# Altium schematic sheet analog.SchDoc: SCOPE-F07x: analog
size A4; Organization: Draw By: OldGerman; Address2: https://github.com; Address3: /oldgerman/SCOPE-F07x; Revision: v1.1; SheetNumber: 2; SheetTotal: 5
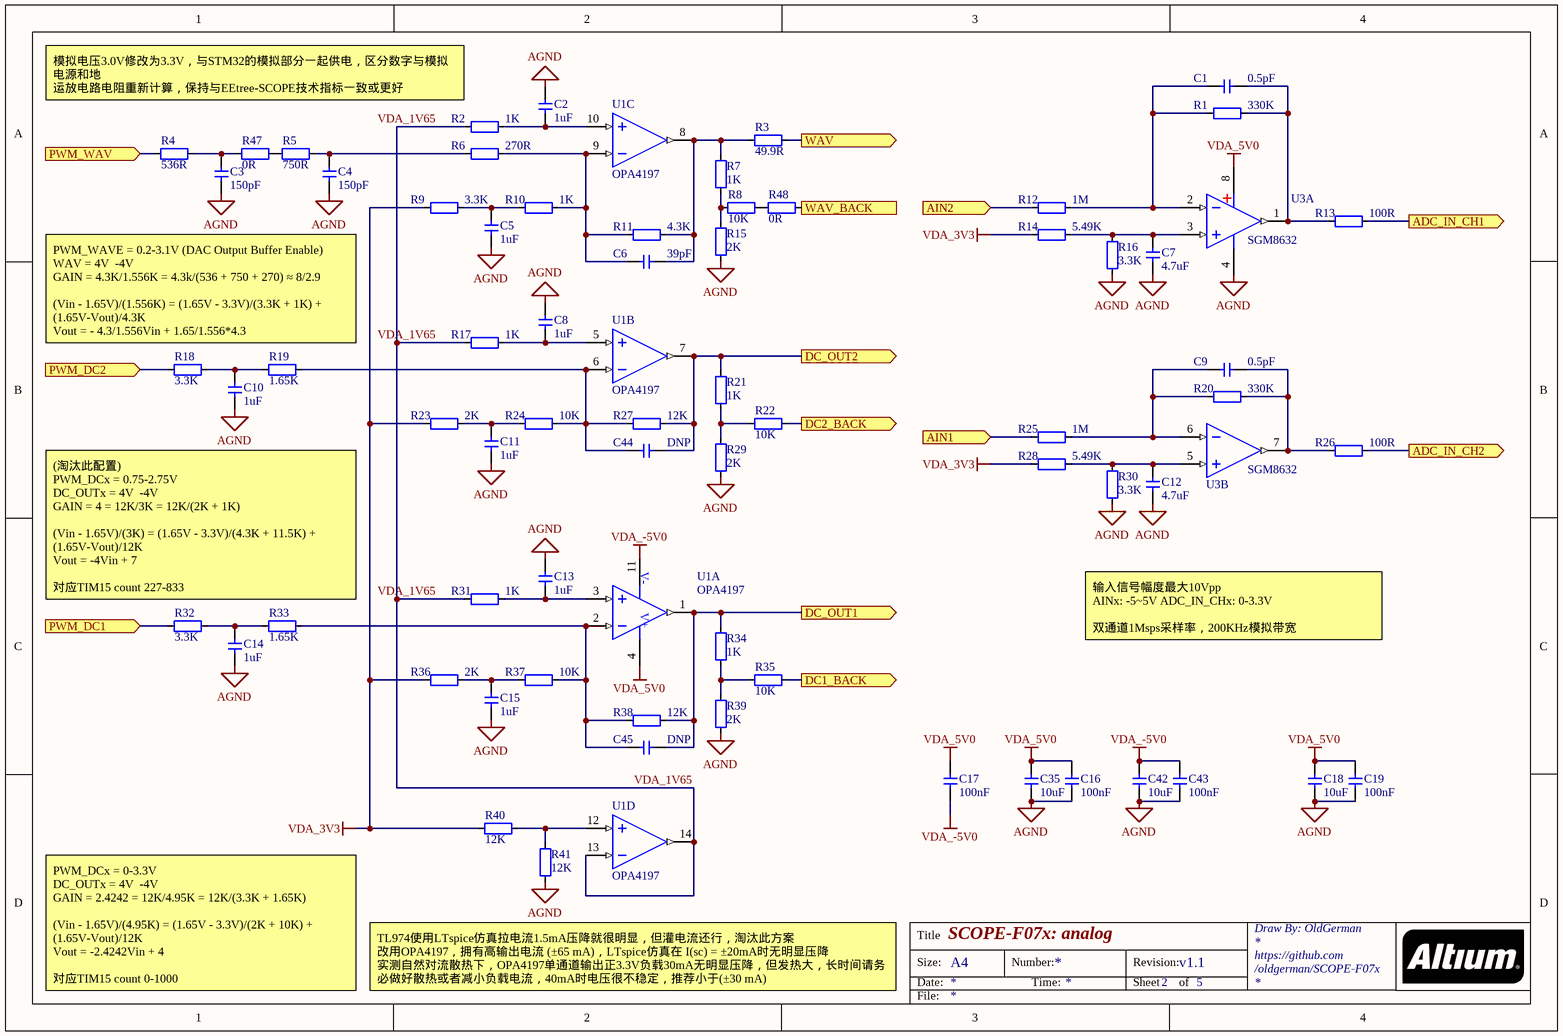
[diagram p0: analog.SchDoc]

## Parts
C1  0.5pF  [C0402]
C2  1uF  [C0402]
C3  150pF  [C0402]
C4  150pF  [C0402]
C5  1uF  [C0402]
C6  39pF  [C0402]
C7  4.7uF  [C0402]
C8  1uF  [C0402]
C9  0.5pF  [C0402]
C10  1uF  [C0402]
C11  1uF  [C0402]
C12  4.7uF  [C0402]
C13  1uF  [C0402]
C14  1uF  [C0402]
C15  1uF  [C0402]
C16  100nF  [C0402]
C17  100nF  [C0402]
C18  10uF  [C0402]
C19  100nF  [C0402]
C35  10uF  [C0402]
C42  10uF  [C0402]
C43  100nF  [C0402]
C44  DNP  [C0402]
C45  DNP  [C0402]
R1  330K  [R0402]
R2  1K  [R0402]
R3  49.9R  [R0402]
R4  536R  [R0402]
R5  750R  [R0402]
R6  270R  [R0402]
R7  1K  [R0402]
R8  10K  [R0402]
R9  3.3K  [R0402]
R10  1K  [R0402]
R11  4.3K  [R0402]
R12  1M  [R0402]
R13  100R  [R0402]
R14  5.49K  [R0402]
R15  2K  [R0402]
R16  3.3K  [R0402]
R17  1K  [R0402]
R18  3.3K  [R0402]
R19  1.65K  [R0402]
R20  330K  [R0402]
R21  1K  [R0402]
R22  10K  [R0402]
R23  2K  [R0402]
R24  10K  [R0402]
R25  1M  [R0402]
R26  100R  [R0402]
R27  12K  [R0402]
R28  5.49K  [R0402]
R29  2K  [R0402]
R30  3.3K  [R0402]
R31  1K  [R0402]
R32  3.3K  [R0402]
R33  1.65K  [R0402]
R34  1K  [R0402]
R35  10K  [R0402]
R36  2K  [R0402]
R37  10K  [R0402]
R38  12K  [R0402]
R39  2K  [R0402]
R40  12K  [R0402]
R41  12K  [R0402]
R47  0R  [R0805]
R48  0R  [R0805]
U1  OPA4197  [ON SEMI TSSOP-14 948G]  (parts A,B,C,D of 4)
U3  SGM8632  [ANALOG DEV SOIC-8 R8]  (parts A,B of 2)

## Ports
ADC_IN_CH1 (out), ADC_IN_CH2 (out), AIN1 (in), AIN2 (in), DC1_BACK (out), DC2_BACK (out), DC_OUT1 (out), DC_OUT2 (out), PWM_DC1 (in), PWM_DC2 (in), PWM_WAV (in), WAV (out), WAV_BACK (out)

## Nets
AGND: C2.2 C3.1 C4.1 C5.1 C7.1 C8.2 C10.1 C11.1 C12.1 C13.2 C14.1 C15.1 C16.1 C18.1 C19.1 C35.1 C42.1 C43.1 R15.1 R16.1 R29.1 R30.1 R39.1 R41.1 U3.4(V-)
VDA_3V3: R9.1 R14.1 R23.1 R28.1 R36.1 R40.1
VDA_5V0: C16.2 C17.2 C18.2 C19.2 C35.2 U1.4(VDD) U3.8(V+)
VDA_-5V0: C17.1 C42.2 C43.2 U1.11(VSS)
ADC_IN_CH1: R13.2 ; port ADC_IN_CH1
ADC_IN_CH2: R26.2 ; port ADC_IN_CH2
AIN1: R25.1 ; port AIN1
AIN2: R12.1 ; port AIN2
DC1_BACK: R35.1 ; port DC1_BACK
DC2_BACK: R22.1 ; port DC2_BACK
DC_OUT1: C45.1 R34.2 R38.2 U1.1(OUTA) ; port DC_OUT1
DC_OUT2: C44.1 R21.2 R27.2 U1.7(OUTB) ; port DC_OUT2
PWM_DC1: R32.1 ; port PWM_DC1
PWM_DC2: R18.1 ; port PWM_DC2
PWM_WAV: R4.1 ; port PWM_WAV
VDA_1V65: R2.1 R17.1 R31.1 U1.13(IN_D-) U1.14(OUTD)
WAV: R3.2 ; port WAV
WAV_BACK: R48.2 ; port WAV_BACK
NetC1_1: C1.1 R1.2 R13.1 U3.1(OUT1)
NetC1_2: C1.2 R1.1 R12.2 U3.2(-)
NetC2_1: C2.1 R2.2 U1.10(IN_C+)
NetC3_2: C3.2 R4.2 R47.1
NetC4_2: C4.2 R5.2 R6.1
NetC5_2: C5.2 R9.2 R10.1
NetC6_1: C6.1 R3.1 R7.2 R11.2 U1.8(OUTC)
NetC6_2: C6.2 R6.2 R10.2 R11.1 U1.9(IN_C-)
NetC7_2: C7.2 R14.2 R16.2 U3.3(+)
NetC8_1: C8.1 R17.2 U1.5(IN_B+)
NetC9_1: C9.1 R20.2 R26.1 U3.7(OUT2)
NetC9_2: C9.2 R20.1 R25.2 U3.6(-)
NetC10_2: C10.2 R18.2 R19.1
NetC11_2: C11.2 R23.2 R24.1
NetC12_2: C12.2 R28.2 R30.2 U3.5(+)
NetC13_1: C13.1 R31.2 U1.3(IN_A+)
NetC14_2: C14.2 R32.2 R33.1
NetC15_2: C15.2 R36.2 R37.1
NetC44_2: C44.2 R19.2 R24.2 R27.1 U1.6(IN_B-)
NetC45_2: C45.2 R33.2 R37.2 R38.1 U1.2(IN_A-)
NetR5_1: R5.1 R47.2
NetR7_1: R7.1 R8.2 R15.2
NetR8_1: R8.1 R48.1
NetR21_1: R21.1 R22.2 R29.2
NetR34_1: R34.1 R35.2 R39.2
NetR40_2: R40.2 R41.2 U1.12(IN_D+)

## Notes on the sheet
- (near R2) 模拟电压3.0V修改为3.3V，与STM32的模拟部分一起供电，区分数字与模拟电源和地
  运放电路电阻重新计算，保持与EEtree-SCOPE技术指标一致或更好
- PWM_WAVE = 0.2-3.1V (DAC Output Buffer Enable)
  WAV = 4V  -4V
  GAIN = 4.3K/1.556K = 4.3k/(536 + 750 + 270) ≈ 8/2.9
  (Vin - 1.65V)/(1.556K) = (1.65V - 3.3V)/(3.3K + 1K) + (1.65V-Vout)/4.3K
  Vout = - 4.3/1.556Vin + 1.65/1.556*4.3
- (淘汰此配置)
  PWM_DCx = 0.75-2.75V
  DC_OUTx = 4V  -4V
  GAIN = 4 = 12K/3K = 12K/(2K + 1K)
  (Vin - 1.65V)/(3K) = (1.65V - 3.3V)/(4.3K + 11.5K) + (1.65V-Vout)/12K
  Vout = -4Vin + 7
  对应TIM15 count 227-833
- 输入信号幅度最大10Vpp
  AINx: -5~5V ADC_IN_CHx: 0-3.3V
  双通道1Msps采样率，200KHz模拟带宽
- PWM_DCx = 0-3.3V
  DC_OUTx = 4V  -4V
  GAIN = 2.4242 = 12K/4.95K = 12K/(3.3K + 1.65K)
  (Vin - 1.65V)/(4.95K) = (1.65V - 3.3V)/(2K + 10K) + (1.65V-Vout)/12K
  Vout = -2.4242Vin + 4
  对应TIM15 count 0-1000
- TL974使用LTspice仿真拉电流1.5mA压降就很明显，但灌电流还行，淘汰此方案
  改用OPA4197，拥有高输出电流 (±65 mA)，LTspice仿真在 I(sc) = ±20mA时无明显压降
  实测自然对流散热下，OPA4197单通道输出正3.3V负载30mA无明显压降，但发热大，长时间请务必做好散热或者减小负载电流，40mA时电压很不稳定，推荐小于(±30 mA)
- Title
- Size:
- Date:
- A4
- Number:
- Time:
- Revision:
- Sheet
- of
- File:
- (in symbol OPA4140AIPWR, part A) V-; V+

## Library data of the parts
C1-C19 C35 C42-C45 = CAP: Capacitor; Value: 0.1u
R1-R41 R47 R48 = RES: Resistor; Value: 22R
U1 = OPA4140AIPWR: Part Number: ADA4622-4; Manufacturer: Analog Devices; Manufacturer Part Number: ADA4622-4ACPZ-RL; Part number IPS: 00000004963; Value: ADA4622; Artikkelnr Noca: N.A.; Pad Count: 17; ComponentLink1URL: https://www.analog.com/media/en/technical-documentation/data-sheets/ada4622-1-4622-2-4622-4.pdf; ComponentLink1Description: Datasheet; ComponentLink2URL: https://www.digikey.no/product-detail/en/analog-devices-inc/ADA4622-4ACPZ-RL/ADA4622-4ACPZ-RL-ND/6490586; ComponentLink2Description: Supplier link; HelpURL: https://www.analog.com/en/products/ada4622-4.html; Footprint Doc: QFN-16; LatestRevisionDate: 2019-06-19; Pin Count: 17; Publisher: Nordic Semiconductor; Published: 2019-06-19; Supplier 1: Digi-Key; Supplier Part Number 1: ADA4622-4ACPZ-R7-ND; Supplier 2: Mouser; Supplier Part Number 2: 584-ADA4622-4ACPZ-R7; Component Class: Misc_ICs; PartId: 101900585
U3 = AD8542: BOM名称: 双运放; 版权归属: 源创客; 学习资源: www.ooocke.com; ComponentLink1Description: 中文数据手册; ComponentLink1URL: https://www.analog.com/media/cn/technical-documentation/data-sheets/AD8541_8542_8544_cn.pdf; ComponentLink2Description: Data Sheet; ComponentLink2URL: https://www.analog.com/media/en/technical-documentation/data-sheets/AD8541_8542_8544.pdf